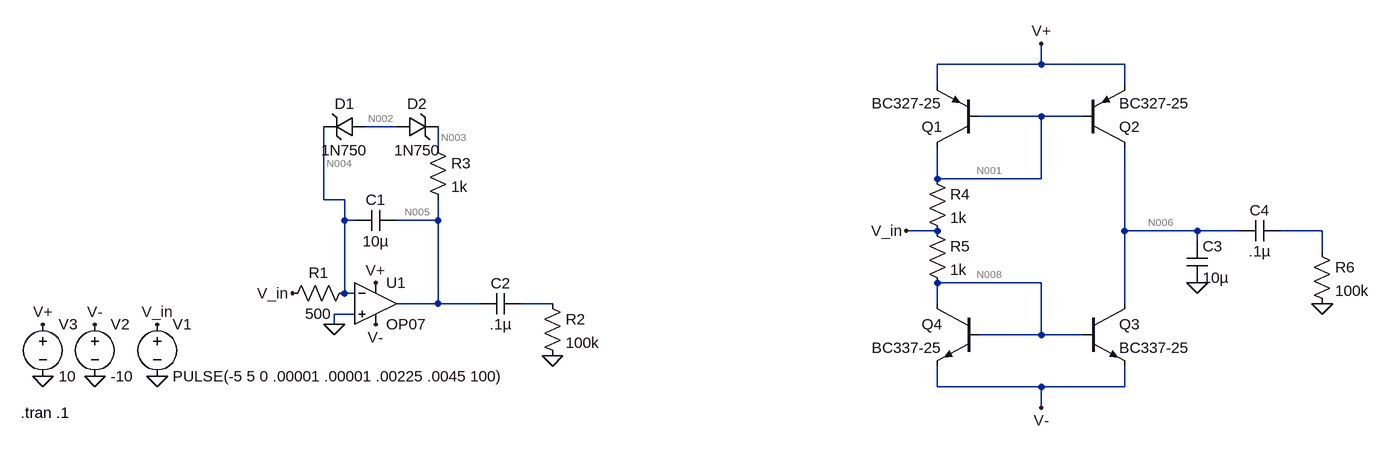
[diagram p0: schematic Draft2.asc]
Draft2.asc, the LTspice schematic file:
Version 4
SHEET 1 1696 680
WIRE 1184 -240 1184 -272
WIRE 1184 -240 1024 -240
WIRE 1312 -240 1184 -240
WIRE 1024 -208 1024 -240
WIRE 1312 -208 1312 -240
WIRE 1184 -160 1088 -160
WIRE 1248 -160 1184 -160
WIRE 192 -144 144 -144
WIRE 256 -112 256 -144
WIRE 1024 -64 1024 -112
WIRE 1184 -64 1184 -160
WIRE 1184 -64 1024 -64
WIRE 80 -32 80 -144
WIRE 112 -32 80 -32
WIRE 112 0 112 -32
WIRE 128 0 112 0
WIRE 256 0 256 -32
WIRE 256 0 192 0
WIRE 1024 16 976 16
WIRE 1312 16 1312 -112
WIRE 1424 16 1312 16
WIRE 1488 16 1424 16
WIRE 1616 16 1552 16
WIRE 1424 32 1424 16
WIRE 1616 48 1616 16
WIRE 1184 96 1024 96
WIRE 112 112 112 0
WIRE 128 112 112 112
WIRE 256 128 256 0
WIRE 256 128 192 128
WIRE 320 128 256 128
WIRE 432 128 384 128
WIRE 1024 128 1024 96
WIRE 1312 128 1312 16
WIRE 128 144 96 144
WIRE 96 160 96 144
WIRE 1184 176 1184 96
WIRE 1184 176 1088 176
WIRE 1248 176 1184 176
WIRE 1024 256 1024 224
WIRE 1184 256 1024 256
WIRE 1312 256 1312 224
WIRE 1312 256 1184 256
WIRE 1184 288 1184 256
FLAG 96 160 0
FLAG -352 240 0
FLAG -272 240 0
FLAG -352 160 V+
FLAG 160 96 V+
FLAG -272 160 V-
FLAG 160 160 V-
FLAG -176 240 0
FLAG 432 208 0
FLAG 1184 -272 V+
FLAG 1184 288 V-
FLAG -176 160 V_in
FLAG 32 112 V_in
FLAG 976 16 V_in
FLAG 1616 128 0
FLAG 1424 96 0
SYMBOL voltage -176 144 R0
WINDOW 123 0 0 Left 0
WINDOW 39 0 0 Left 0
SYMATTR InstName V1
SYMATTR Value PULSE(-5 5 0 .00001 .00001 .00225 .0045 100)
SYMBOL voltage -272 144 R0
WINDOW 123 0 0 Left 0
WINDOW 39 0 0 Left 0
SYMATTR InstName V2
SYMATTR Value -10
SYMBOL voltage -352 144 R0
WINDOW 123 0 0 Left 0
WINDOW 39 0 0 Left 0
SYMATTR InstName V3
SYMATTR Value 10
SYMBOL res 128 96 R90
WINDOW 0 0 56 VBottom 2
WINDOW 3 32 56 VTop 2
SYMATTR InstName R1
SYMATTR Value 500
SYMBOL cap 192 -16 R90
WINDOW 0 0 32 VBottom 2
WINDOW 3 32 32 VTop 2
SYMATTR InstName C1
SYMATTR Value 10µ
SYMBOL cap 384 112 R90
WINDOW 0 0 32 VBottom 2
WINDOW 3 32 32 VTop 2
SYMATTR InstName C2
SYMATTR Value .1µ
SYMBOL res 416 112 R0
SYMATTR InstName R2
SYMATTR Value 100k
SYMBOL Opamps\\OP07 160 64 R0
SYMATTR InstName U1
SYMBOL zener 144 -160 R90
WINDOW 0 -4 32 VBottom 2
WINDOW 3 36 32 VTop 2
SYMATTR InstName D1
SYMATTR Value 1N750
SYMBOL zener 192 -128 R270
WINDOW 0 36 32 VTop 2
WINDOW 3 -4 32 VBottom 2
SYMATTR InstName D2
SYMATTR Value 1N750
SYMBOL res 240 -128 R0
SYMATTR InstName R3
SYMATTR Value 1k
SYMBOL pnp 1088 -112 R180
SYMATTR InstName Q1
SYMATTR Value BC327-25
SYMBOL pnp 1248 -112 M180
SYMATTR InstName Q2
SYMATTR Value BC327-25
SYMBOL npn 1248 128 R0
SYMATTR InstName Q3
SYMATTR Value BC337-25
SYMBOL npn 1088 128 M0
SYMATTR InstName Q4
SYMATTR Value BC337-25
SYMBOL res 1008 -80 R0
SYMATTR InstName R4
SYMATTR Value 1k
SYMBOL res 1008 0 R0
SYMATTR InstName R5
SYMATTR Value 1k
SYMBOL cap 1408 32 R0
SYMATTR InstName C3
SYMATTR Value 10µ
SYMBOL cap 1552 0 R90
WINDOW 0 0 32 VBottom 2
WINDOW 3 32 32 VTop 2
SYMATTR InstName C4
SYMATTR Value .1µ
SYMBOL res 1600 32 R0
SYMATTR InstName R6
SYMATTR Value 100k
TEXT -386 296 Left 2 !.tran .1

The netlist it stands for:
* Draft2.asc
V1 V_in 0 PULSE(-5 5 0 .00001 .00001 .00225 .0045 100)
V2 V- 0 -10
V3 V+ 0 10
R1 N004 V_in 500
C1 N005 N004 10µ
C2 N009 N005 .1µ
R2 N009 0 100k
XU1 0 N004 V+ V- N005 LT1001  ; OP07, pins In+ In- V+ V- OUT
D1 N002 N004 1N750
D2 N002 N003 1N750
R3 N003 N005 1k
Q1 N001 N001 V+ 0 BC327-25
Q2 N006 N001 V+ 0 BC327-25
Q3 N006 N008 V- 0 BC337-25
Q4 N008 N008 V- 0 BC337-25
R4 N001 V_in 1k
R5 V_in N008 1k
C3 N006 0 10µ
C4 N007 N006 .1µ
R6 N007 0 100k
.model D D
.lib standard.dio
.model NPN NPN
.model PNP PNP
.lib standard.bjt
.tran .1
.lib LTC.lib
.backanno
.end

* Results of the author's LTspice run, read from the files saved beside the schematic
* Operating Point, zero values left out:
*   V(v_in) = -5 V
*   V(v-) = -10 V
*   V(v+) = 10 V
*   V(n004) = -2.021 V
*   V(n005) = 8.872 V
*   V(n002) = -1.262 V
*   V(n003) = 3.366 V
*   V(n001) = 9.341 V
*   V(n006) = 9.98 V
*   V(n008) = -9.353 V
*   Ic(Q4) = 4.322 mA
*   Ib(Q4) = 15.73 µA
*   Ie(Q4) = -4.337 mA
*   Ic(Q3) = 4.902 mA
*   Ib(Q3) = 15.69 µA
*   Ie(Q3) = -4.918 mA
*   Ic(Q2) = -4.902 mA
*   Ib(Q2) = -569.7 µA
*   Ie(Q2) = 5.472 mA
*   Ic(Q1) = -13.73 mA
*   Ib(Q1) = -41.33 µA
*   Ie(Q1) = 13.77 mA
*   I(D2) = -5.506 mA
*   I(D1) = 5.506 mA
*   I(R5) = 4.353 mA
*   I(R4) = 14.34 mA
*   I(R3) = -5.506 mA
*   I(R1) = 5.959 mA
*   I(V3) = -25.08 mA
*   I(V2) = 9.596 mA
*   I(V1) = 15.95 mA
*   Ix(u1:1) = 452.8 µA
*   Ix(u1:2) = -452.8 µA
*   Ix(u1:3) = 5.839 mA
*   Ix(u1:4) = -340.5 µA
*   Ix(u1:5) = -5.506 mA
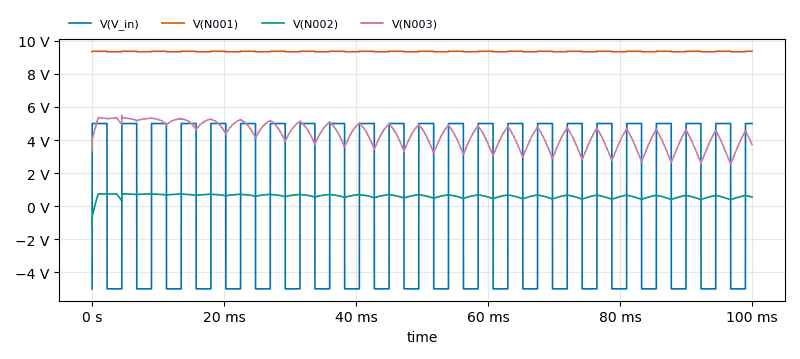
[diagram p1: Transient Analysis of Draft2.asc, plotted from the saved traces]
* Transient Analysis, 1 run:
*   V(V_in): min -5 V, max 5 V, average 71.5 mV, rms 4.993 V, last 5 V
*   V(N001): min 9.34 V, max 9.373 V, average 9.356 V, rms 9.356 V, last 9.372 V
*   V(N002): min -1.262 V, max 890.1 mV, average 611.7 mV, rms 620.7 mV, last 550.2 mV
*   V(N003): min 2.542 V, max 5.495 V, average 4.329 V, rms 4.385 V, last 3.735 V